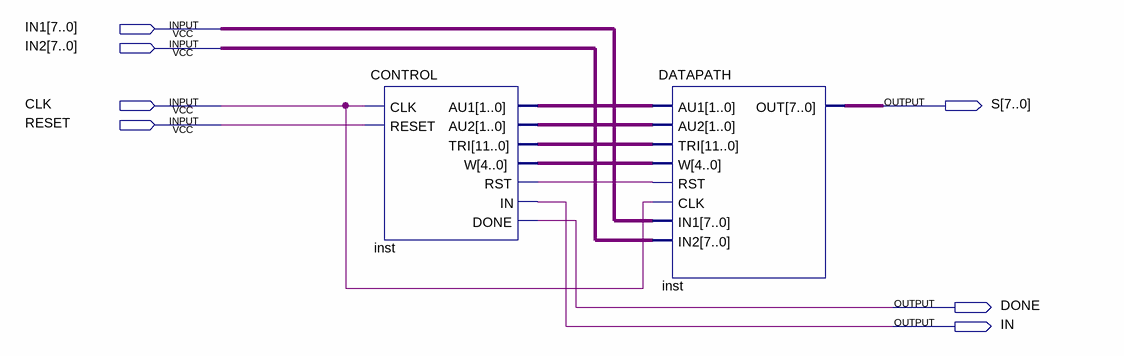
[diagram p0: schematic sheet]
// Quartus schematic SRA_DTP_PL.bdf as structural Verilog: 2 symbols, 7 pins
module SRA_DTP_PL (
  input  [7:0] IN1,
  input  [7:0] IN2,
  input  CLK,
  input  RESET,
  output [7:0] S,
  output DONE,
  output IN
);

  wire inst_rst;
  wire [1:0] inst_au1, inst_au2;
  wire [4:0] inst_w;
  wire [11:0] inst_tri;

  CONTROL inst (
    .CLK(CLK), .RESET(RESET), .AU1(inst_au1), .AU2(inst_au2), .TRI(inst_tri), .W(inst_w), .DONE(DONE),
    .IN(IN), .RST(inst_rst));
  DATAPATH inst_dup2 (
    .RST(inst_rst), .IN1(IN1), .AU1(inst_au1), .AU2(inst_au2), .IN2(IN2), .TRI(inst_tri), .CLK(CLK),
    .W(inst_w), .OUT(S));
endmodule
